# Altium schematic sheet COVER PAGE.SchDoc: C-F-U-Bridge
size A3; DrawnBy: Luca Schenetti; Engineer: Luca Schenetti; Revision: A; SheetNumber: 1; SheetTotal: 7; Material: JLC06161H-3313
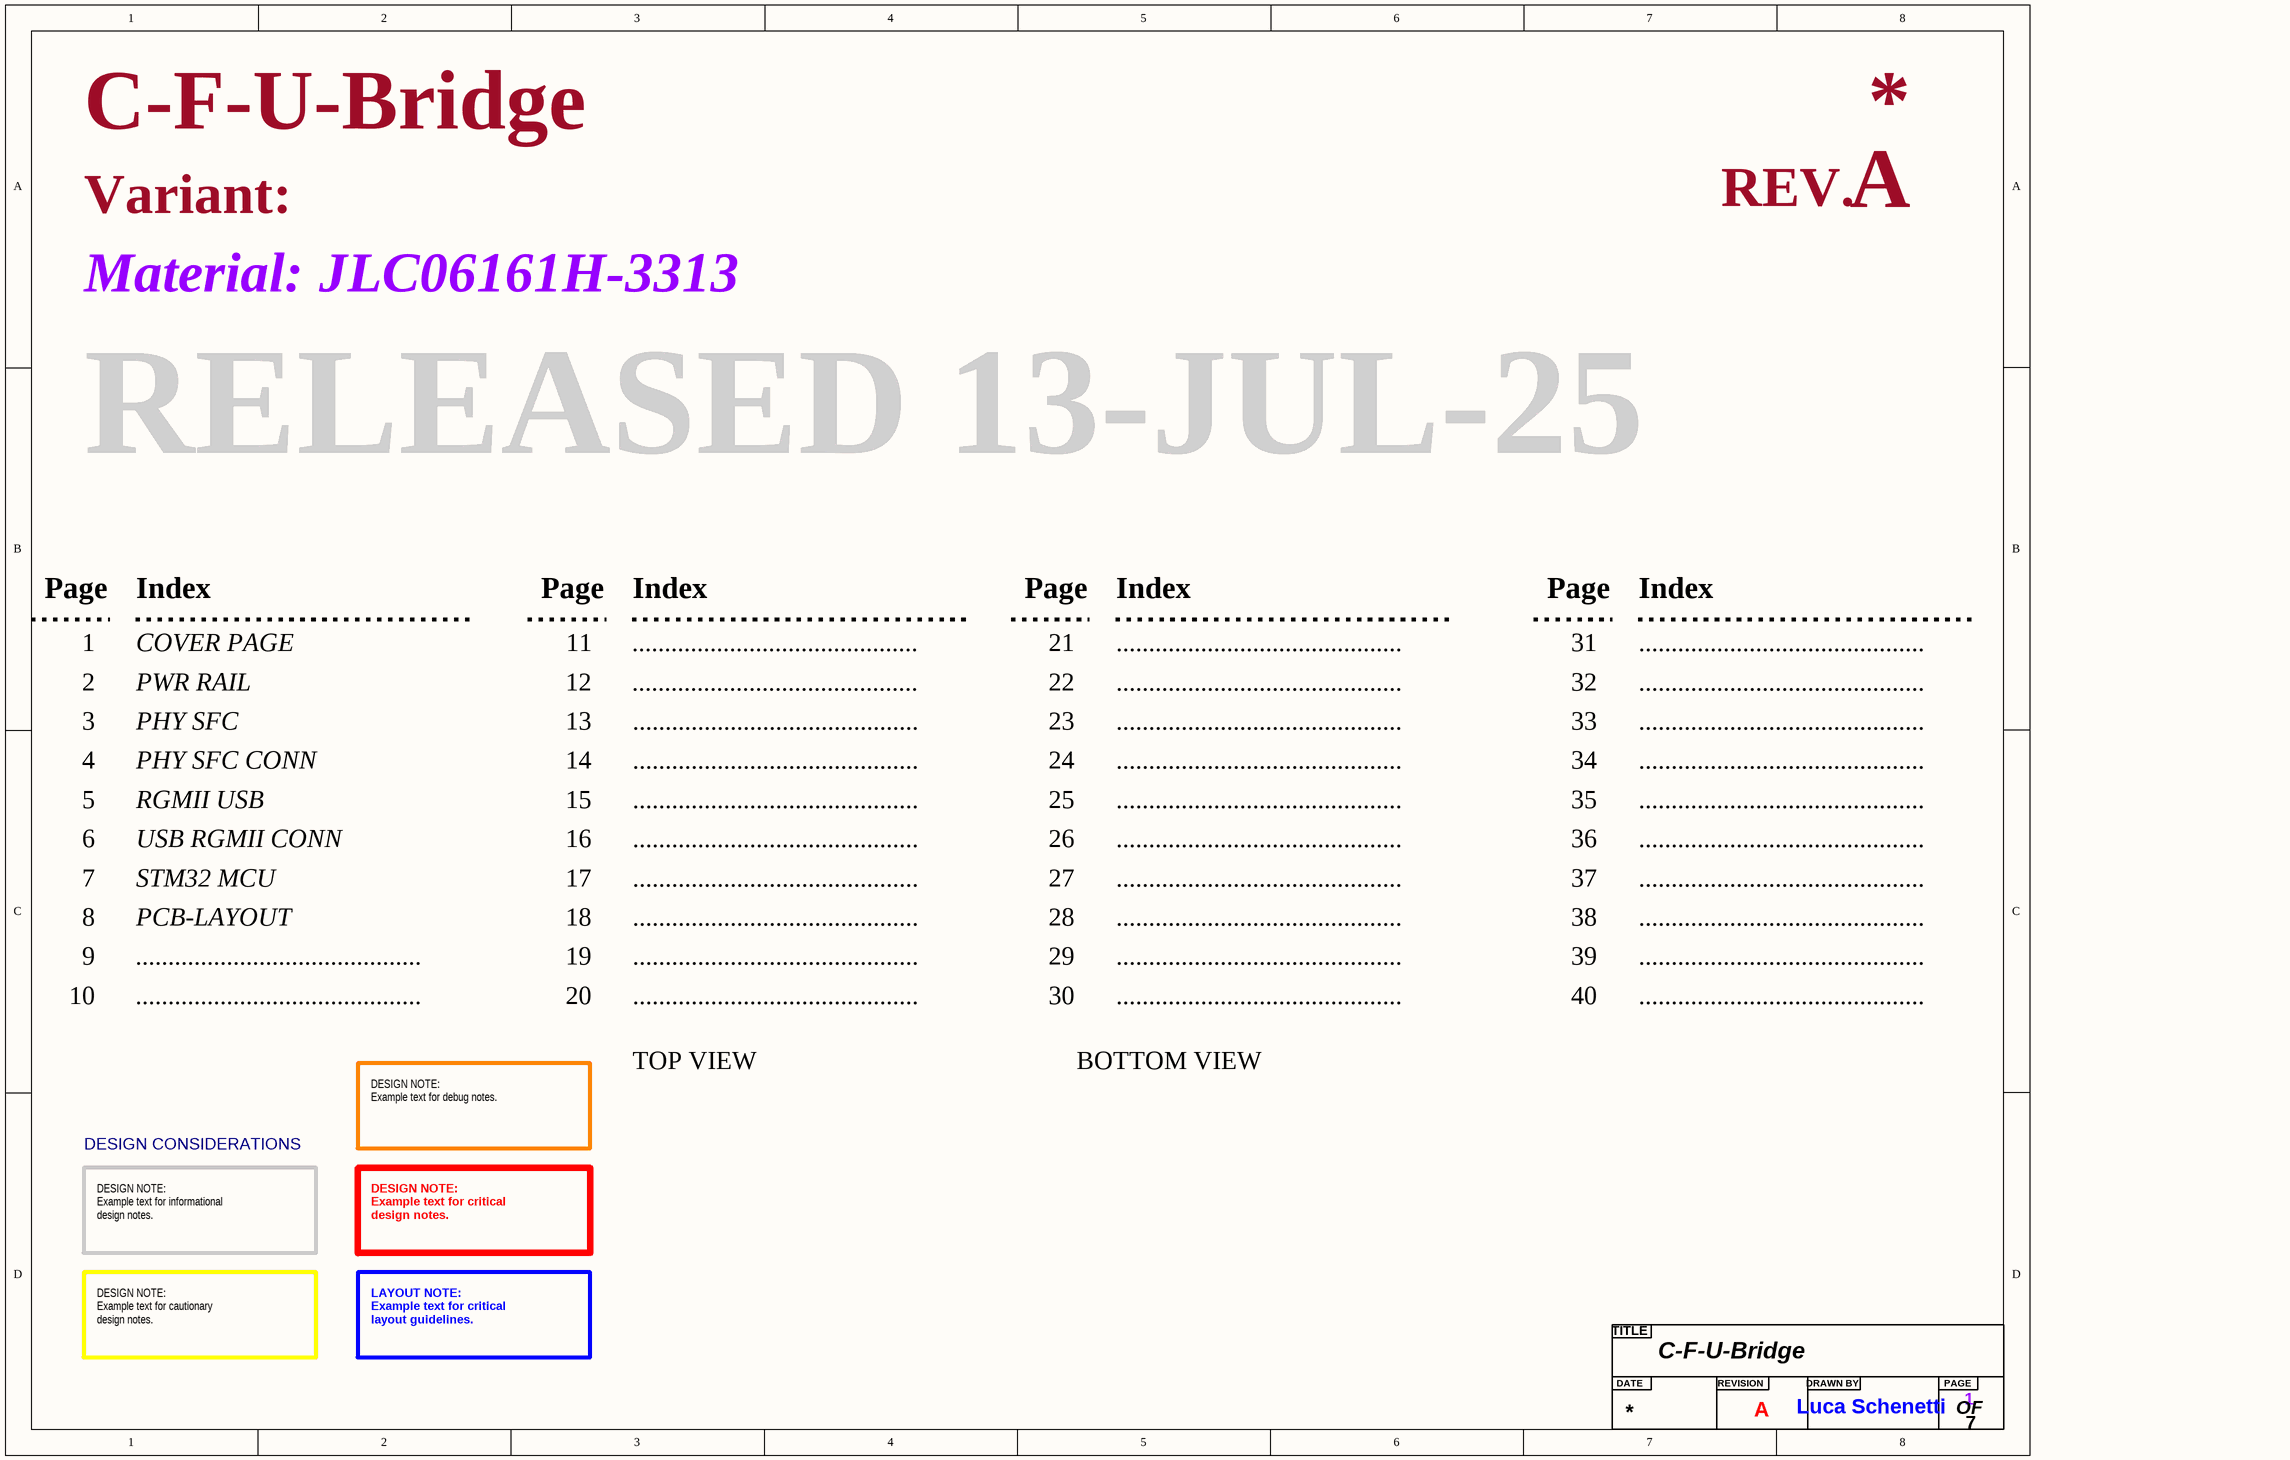
[diagram p0: COVER PAGE.SchDoc]

## Parts
?  Title  (value not drawn)  (graphical)

## Notes on the sheet
- Variant:
- REV.
- Material:
- RELEASED 13-JUL-25
- Page
- Index
- 1
- 2
- COVER PAGE
- PWR RAIL
- 11
- 12
- ............................................
- 21
- 22
- 31
- 32
- 3
- PHY SFC
- 13
- 23
- 33
- 4
- 5
- PHY SFC CONN
- RGMII USB
- 14
- 15
- 24
- 25
- 34
- 35
- 6
- 7
- STM32 MCU
- USB RGMII CONN
- 16
- 17
- 26
- 27
- 36
- 37
- 8
- PCB-LAYOUT
- 18
- 28
- 38
- 9
- 10
- 19
- 20
- 29
- 30
- 39
- 40
- TOP VIEW
- BOTTOM VIEW
- DESIGN CONSIDERATIONS
- DESIGN NOTE:
  Example text for debug notes.
- DESIGN NOTE:
  Example text for informational
  design notes.
- DESIGN NOTE:
  Example text for critical
  design notes.
- DESIGN NOTE:
  Example text for cautionary
  design notes.
- LAYOUT NOTE:
  Example text for critical
  layout guidelines.
- (in symbol Title) TITLE; DATE; REVISION; DRAWN BY; PAGE; OF